# EAGLE design mainboard (EAGLE 6.1)

## Sheet 1 of 2
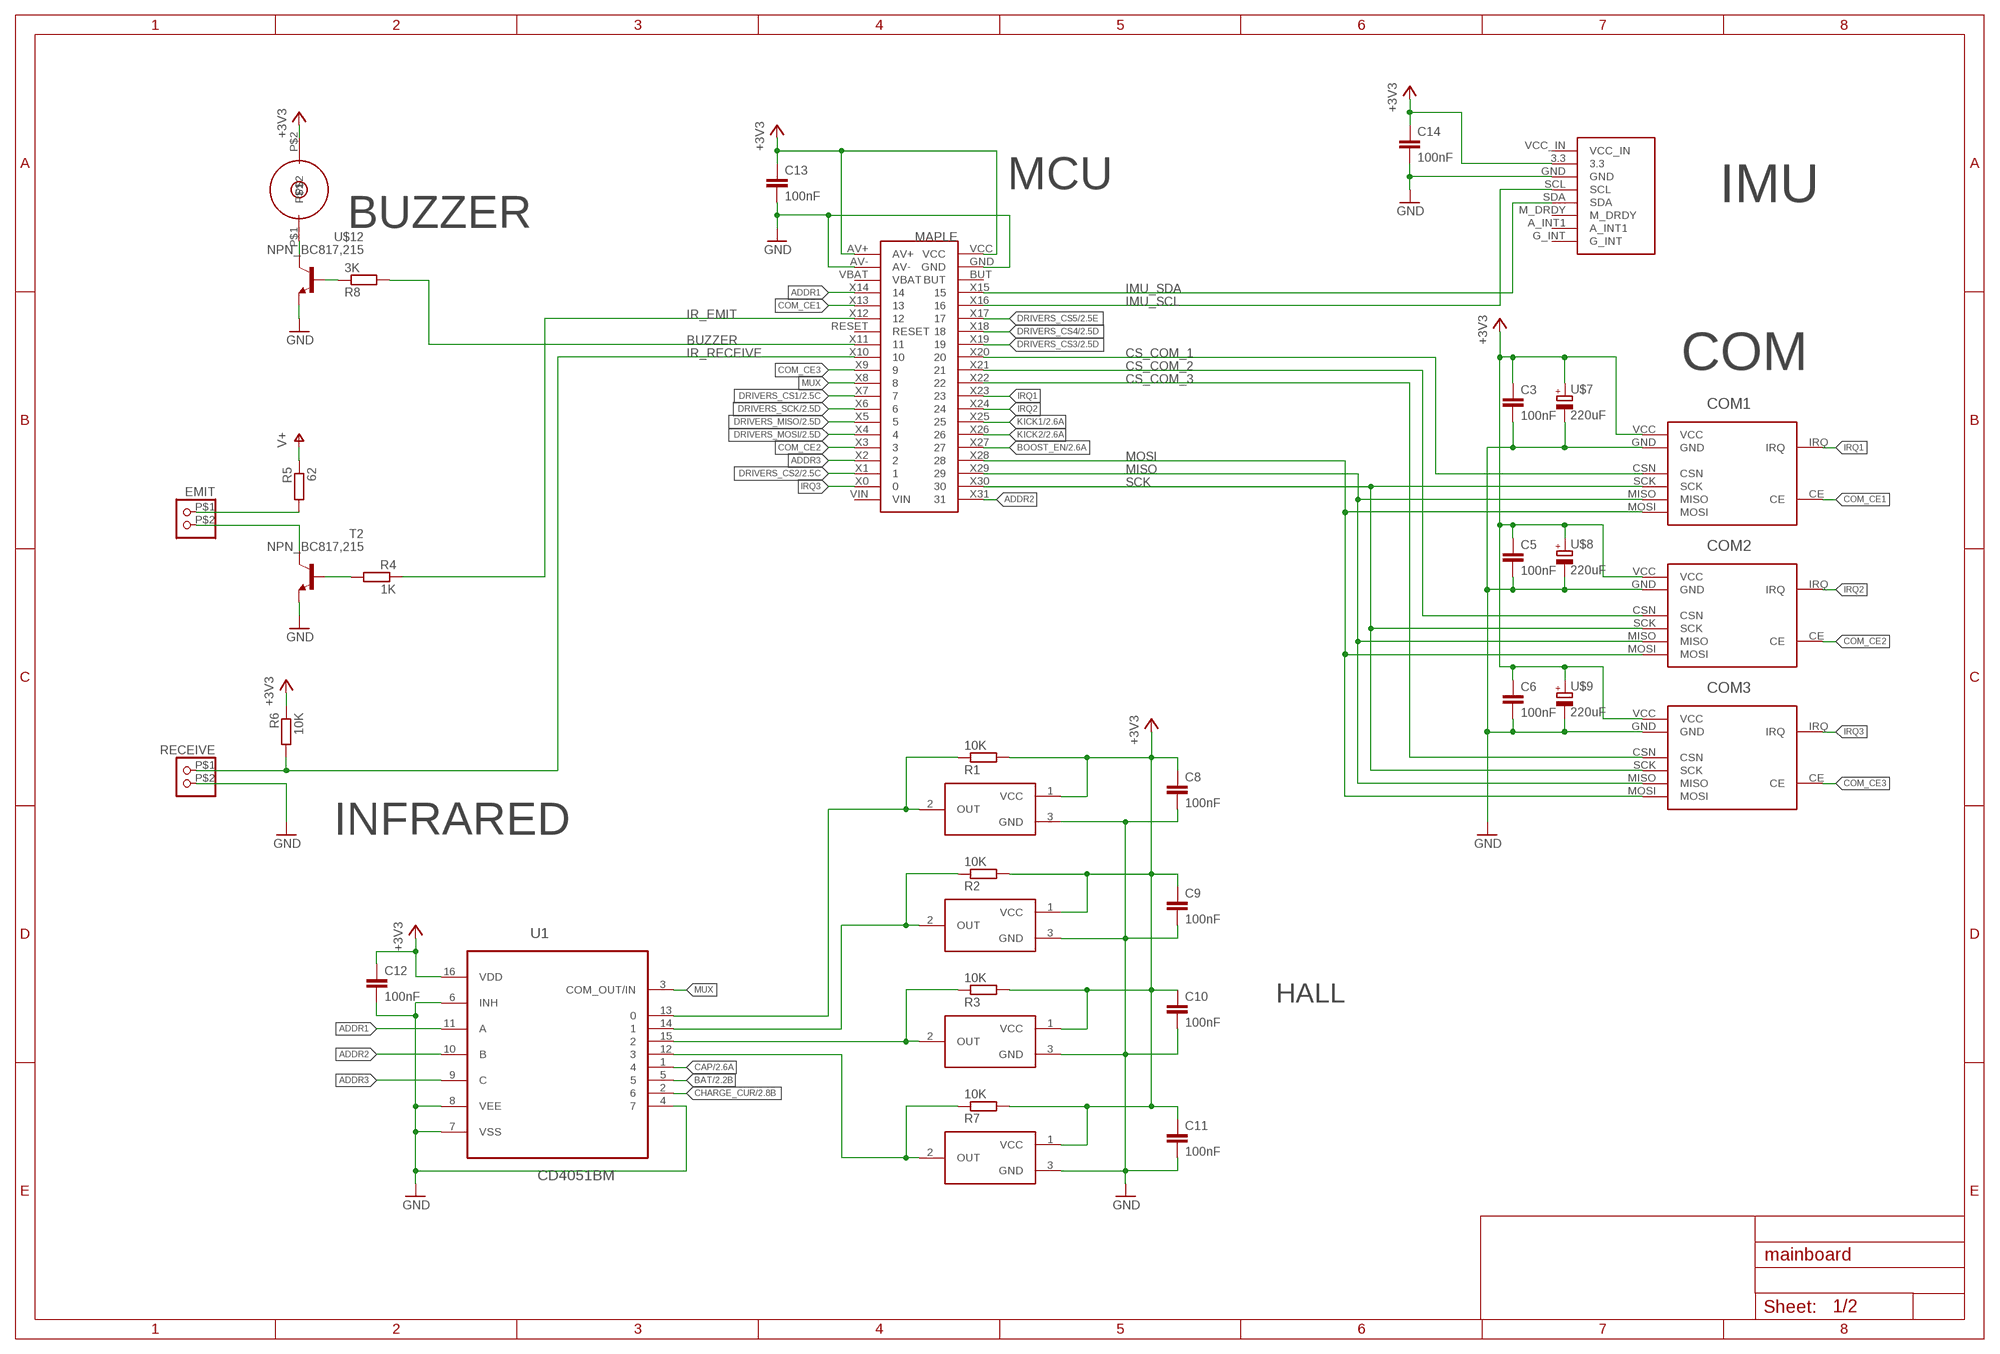
[diagram p0: schematic, sheet 1]

### Parts
C3  100nF  CAP0805  [0805@1]
C5  100nF  CAP0805  [0805@1]
C6  100nF  CAP0805  [0805@1]
C8  100nF  CAP0805  [0805@1]
C9  100nF  CAP0805  [0805@1]
C10  100nF  CAP0805  [0805@1]
C11  100nF  CAP0805  [0805@1]
C12  100nF  CAP0805  [0805@1]
C13  100nF  CAP0805  [0805@1]
C14  100nF  CAP0805  [0805@1]
COM1  NRF24L01  [NRF24L01]
COM2  NRF24L01  [NRF24L01]
COM3  NRF24L01  [NRF24L01]
EMIT  CONNEC_1X02JST-ZH  [JST_ZH_2P]
MAPLE  MAPLE_MINI  [CONNEC_2X20]
R1  10K  RESISTANCE-R0805  [R0805]
R2  10K  RESISTANCE-R0805  [R0805]
R3  10K  RESISTANCE-R0805  [R0805]
R4  1K  RESISTANCE-R0805  [R0805]
R5  62  RESISTANCE-R0805  [R0805]
R6  10K  RESISTANCE-R0805  [R0805]
R7  10K  RESISTANCE-R0805  [R0805]
R8  3K  R-EU_R0805  [R0805]
RECEIVE  CONNEC_1X02JST-ZH  [JST_ZH_2P]
T2  NPN_BC817,215  [SOT-23]
U1  CD4051BM  [SOIC127P600X175-16N]
U$1  DRV5023FAEDBZRQ1  [SOT-23]
U$2  GY-85  [GY-85]
U$5  DRV5023FAEDBZRQ1  [SOT-23]
U$7  220uF  CPOL_EUPANASONIC_D8  [PANASONIC_D8]
U$8  220uF  CPOL_EUPANASONIC_D8  [PANASONIC_D8]
U$9  220uF  CPOL_EUPANASONIC_D8  [PANASONIC_D8]
U$10  DRV5023FAEDBZRQ1  [SOT-23]
U$11  DRV5023FAEDBZRQ1  [SOT-23]
U$12  NPN_BC817,215  [SOT-23]
U$13  BUZZER66  [BUZZER66]

### Nets
+3V3: C3.1 C5.1 C6.1 C8.1 C9.1 C10.1 C11.1 C12.1 C13.1 C14.1 COM1.VCC COM2.VCC COM3.VCC MAPLE.AV+ MAPLE.VCC R1.2 R2.2 R3.2 R6.1 R7.2 U1.16(VDD) U$1.1(VCC) U$2.3.3 U$5.1(VCC) U$7.+ U$8.+ U$9.+ U$10.1(VCC) U$11.1(VCC) U$13.P$2 ; also sheet 2
ADDR1: MAPLE.X14 U1.11(A)
ADDR2: MAPLE.X31 U1.10(B)
ADDR3: MAPLE.X2 U1.9(C)
BAT: U1.5 ; also sheet 2
BOOST_EN: MAPLE.X27 ; also sheet 2
BUZZER: MAPLE.X11 R8.2
CAP: U1.1 ; also sheet 2
CHARGE_CUR: U1.2 ; also sheet 2
COM_CE1: COM1.CE MAPLE.X13
COM_CE2: COM2.CE MAPLE.X3
COM_CE3: COM3.CE MAPLE.X9
CS_COM_1: COM1.CSN MAPLE.X20
CS_COM_2: COM2.CSN MAPLE.X21
CS_COM_3: COM3.CSN MAPLE.X22
DRIVERS_CS1: MAPLE.X7 ; also sheet 2
DRIVERS_CS2: MAPLE.X1 ; also sheet 2
DRIVERS_CS3: MAPLE.X19 ; also sheet 2
DRIVERS_CS4: MAPLE.X18 ; also sheet 2
DRIVERS_CS5: MAPLE.X17 ; also sheet 2
DRIVERS_MISO: MAPLE.X5 ; also sheet 2
DRIVERS_MOSI: MAPLE.X4 ; also sheet 2
DRIVERS_SCK: MAPLE.X6 ; also sheet 2
GND [alim_big]: C3.2 C5.2 C6.2 C8.2 C9.2 C10.2 C11.2 C12.2 C13.2 C14.2 COM1.GND COM2.GND COM3.GND MAPLE.AV- MAPLE.GND RECEIVE.P$2 T2.2(E) U1.4 U1.6(INH) U1.7(VSS) U1.8(VEE) U$1.3(GND) U$2.GND U$5.3(GND) U$7.- U$8.- U$9.- U$10.3(GND) U$11.3(GND) U$12.2(E) ; also sheet 2
HALL1: R1.1 U1.13 U$1.2(OUT)
HALL2: R2.1 U1.14 U$5.2(OUT)
HALL3: R3.1 U1.15 U$10.2(OUT)
HALL4: R7.1 U1.12 U$11.2(OUT)
IMU_SCL: MAPLE.X16 U$2.SCL
IMU_SDA: MAPLE.X15 U$2.SDA
IR_EMIT: MAPLE.X12 R4.1
IR_RECEIVE: MAPLE.X10 R6.2 RECEIVE.P$1
IRQ1: COM1.IRQ MAPLE.X23
IRQ2: COM2.IRQ MAPLE.X24
IRQ3: COM3.IRQ MAPLE.X0
KICK1: MAPLE.X25 ; also sheet 2
KICK2: MAPLE.X26 ; also sheet 2
MISO: COM1.MISO COM2.MISO COM3.MISO MAPLE.X29
MOSI: COM1.MOSI COM2.MOSI COM3.MOSI MAPLE.X28
MUX: MAPLE.X8 U1.3(COM_OUT/IN)
N$3: R8.1 U$12.1(B)
N$5: U$12.3(C) U$13.P$1
N$6: EMIT.P$1 R5.2
N$7: EMIT.P$2 T2.3(C)
N$11: R4.2 T2.1(B)
SCK: COM1.SCK COM2.SCK COM3.SCK MAPLE.X30
V+ [alim_small]: R5.1 ; also sheet 2
Unconnected: MAPLE.BUT MAPLE.RESET MAPLE.VBAT MAPLE.VIN U$2.A_INT1 U$2.G_INT U$2.M_DRDY U$2.VCC_IN

### Notes on the sheet
- MCU | IMU
- BUZZER
- COM
- INFRARED
- HALL

## Sheet 2 of 2
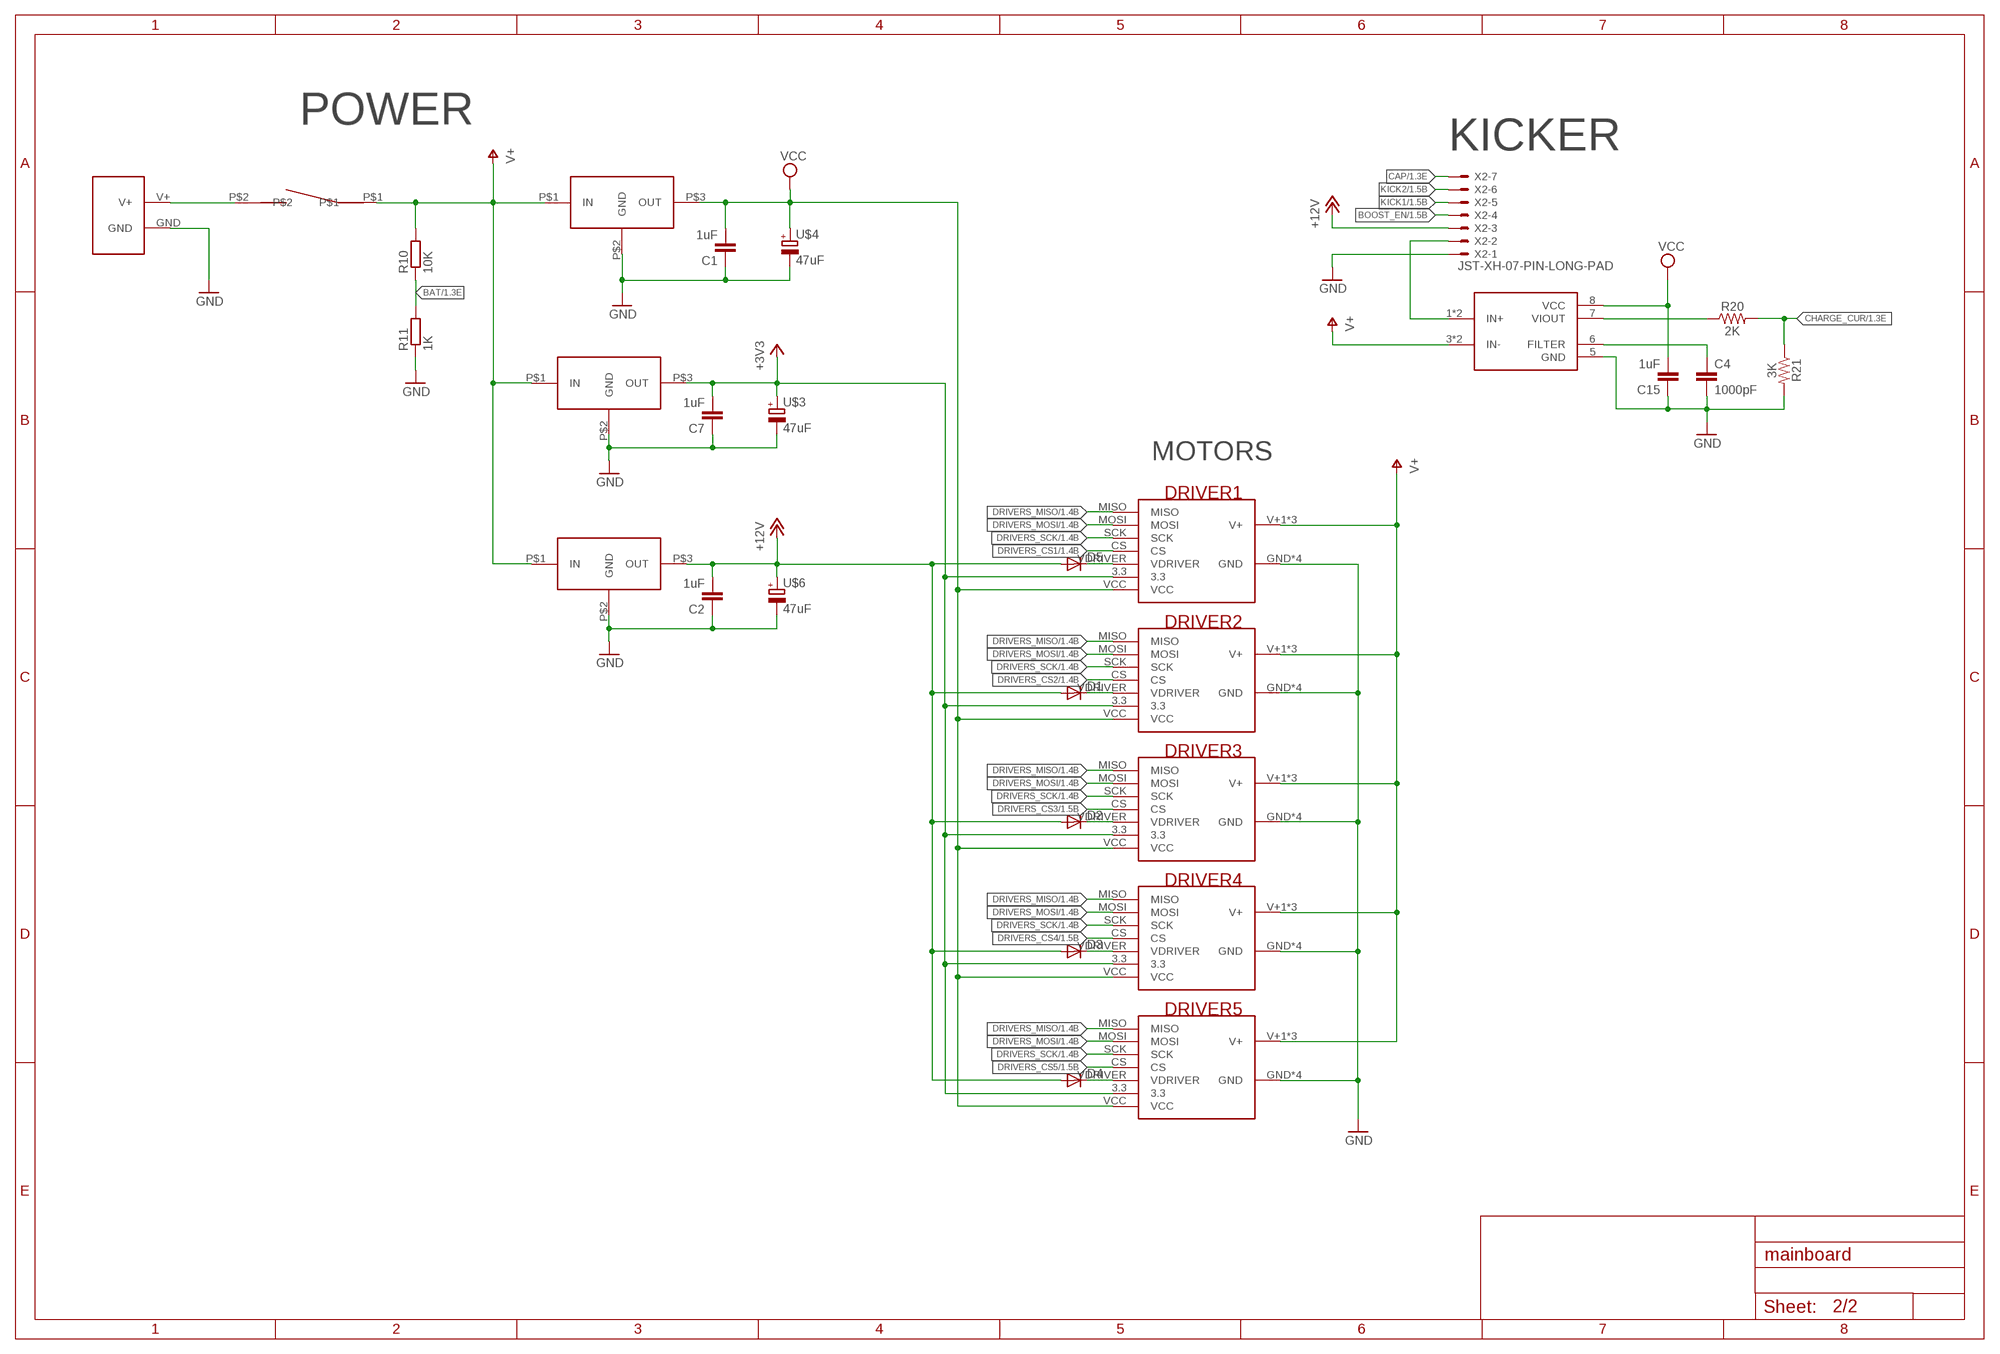
[diagram p1: schematic, sheet 2]

### Parts
C1  1uF  CAP0805  [0805@1]
C2  1uF  CAP0805  [0805@1]
C4  1000pF  CAP0805  [0805@1]
C7  1uF  CAP0805  [0805@1]
C15  1uF  CAP0805  [0805@1]
D1  DIODESOD  [SOD-323]
D2  DIODESOD  [SOD-323]
D3  DIODESOD  [SOD-323]
D4  DIODESOD  [SOD-323]
D5  DIODESOD  [SOD-323]
DRIVER1  RHOBAN_BL_DRIVER  [RHOBAN_BL_DRIVER]
DRIVER2  RHOBAN_BL_DRIVER  [RHOBAN_BL_DRIVER]
DRIVER3  RHOBAN_BL_DRIVER  [RHOBAN_BL_DRIVER]
DRIVER4  RHOBAN_BL_DRIVER  [RHOBAN_BL_DRIVER]
DRIVER5  RHOBAN_BL_DRIVER  [RHOBAN_BL_DRIVER]
R10  10K  RESISTANCE-R0805  [R0805]
R11  1K  RESISTANCE-R0805  [R0805]
R20  2K  RESISTOR0805  [0805]
R21  3K  RESISTOR0805  [0805]
REG3.3V  REG_5V  [TRACOPOWER]
REG3.3V1  REG_5V  [TRACOPOWER]
REG5V  REG_5V  [TRACOPOWER]
SENSE  ACS712  [SO8]
U$3  47uF  CPOL_EUPANASONIC_D  [PANASONIC_D]
U$4  47uF  CPOL_EUPANASONIC_D  [PANASONIC_D]
U$6  47uF  CPOL_EUPANASONIC_D  [PANASONIC_D]
U$15  SRB22A2FBBNN  [SRB22A2FBBNN]
X2  JST-XH-07-PIN-LONG-PAD  [JST-XH-07-PACKAGE-LONG-PAD]
XT60  CONNEC_ALIM  [XT60]

### Nets
+3V3: C7.2 DRIVER1.3.3 DRIVER2.3.3 DRIVER3.3.3 DRIVER4.3.3 DRIVER5.3.3 REG3.3V.P$3(OUT) U$3.+ ; also sheet 1
+12V: C2.2 D1.2(A) D2.2(A) D3.2(A) D4.2(A) D5.2(A) REG3.3V1.P$3(OUT) U$6.+ X2.3
BAT: R10.1 R11.2 ; also sheet 1
BOOST_EN: X2.4 ; also sheet 1
CAP: X2.7 ; also sheet 1
CHARGE_CUR: R20.2 R21.1 ; also sheet 1
DRIVERS_CS1: DRIVER1.CS ; also sheet 1
DRIVERS_CS2: DRIVER2.CS ; also sheet 1
DRIVERS_CS3: DRIVER3.CS ; also sheet 1
DRIVERS_CS4: DRIVER4.CS ; also sheet 1
DRIVERS_CS5: DRIVER5.CS ; also sheet 1
DRIVERS_MISO: DRIVER1.MISO DRIVER2.MISO DRIVER3.MISO DRIVER4.MISO DRIVER5.MISO ; also sheet 1
DRIVERS_MOSI: DRIVER1.MOSI DRIVER2.MOSI DRIVER3.MOSI DRIVER4.MOSI DRIVER5.MOSI ; also sheet 1
DRIVERS_SCK: DRIVER1.SCK DRIVER2.SCK DRIVER3.SCK DRIVER4.SCK DRIVER5.SCK ; also sheet 1
GND [alim_big]: C1.1 C2.1 C4.2 C7.1 C15.1 DRIVER1.GND DRIVER1.GND2(GND) DRIVER1.GND3(GND) DRIVER1.GND4(GND) DRIVER2.GND DRIVER2.GND2(GND) DRIVER2.GND3(GND) DRIVER2.GND4(GND) DRIVER3.GND DRIVER3.GND2(GND) DRIVER3.GND3(GND) DRIVER3.GND4(GND) DRIVER4.GND DRIVER4.GND2(GND) DRIVER4.GND3(GND) DRIVER4.GND4(GND) DRIVER5.GND DRIVER5.GND2(GND) DRIVER5.GND3(GND) DRIVER5.GND4(GND) R11.1 R21.2 REG3.3V1.P$2(GND) REG3.3V.P$2(GND) REG5V.P$2(GND) SENSE.5(GND) U$3.- U$4.- U$6.- X2.1 XT60.GND ; also sheet 1
KICK1: X2.5 ; also sheet 1
KICK2: X2.6 ; also sheet 1
N$1: U$15.P$2 XT60.V+
N$2: C4.1 SENSE.6(FILTER)
N$4: SENSE.1(IN+) SENSE.2(IN+) X2.2
N$8: D5.1(C) DRIVER1.VDRIVER
N$9: D3.1(C) DRIVER4.VDRIVER
N$10: D4.1(C) DRIVER5.VDRIVER
N$12: D2.1(C) DRIVER3.VDRIVER
N$13: D1.1(C) DRIVER2.VDRIVER
N$24: R20.1 SENSE.7(VIOUT)
V+ [alim_small]: DRIVER1.V+1(V+) DRIVER1.V+2(V+) DRIVER1.V+3(V+) DRIVER2.V+1(V+) DRIVER2.V+2(V+) DRIVER2.V+3(V+) DRIVER3.V+1(V+) DRIVER3.V+2(V+) DRIVER3.V+3(V+) DRIVER4.V+1(V+) DRIVER4.V+2(V+) DRIVER4.V+3(V+) DRIVER5.V+1(V+) DRIVER5.V+2(V+) DRIVER5.V+3(V+) R10.2 REG3.3V1.P$1(IN) REG3.3V.P$1(IN) REG5V.P$1(IN) SENSE.3(IN-) SENSE.4(IN-) U$15.P$1 ; also sheet 1
VCC [alim_small]: C1.2 C15.2 DRIVER1.VCC DRIVER2.VCC DRIVER3.VCC DRIVER4.VCC DRIVER5.VCC REG5V.P$3(OUT) SENSE.8(VCC) U$4.+

### Notes on the sheet
- POWER
- KICKER
- MOTORS

## Library data of the parts
C1-C3 C5-C15 = SparkFun-Passives:CAP: Capacitor Standard 0603 ceramic capacitor, and 0.1" leaded capacitor.; FARNELL: 2496946
C4 = SparkFun-Passives:CAP: Capacitor Standard 0603 ceramic capacitor, and 0.1" leaded capacitor.; FARNELL: 2496935
COM1-COM3 = rhoban:NRF24L01; FARNELL: 1668343
D1-D5 = SparkFun-DiscreteSemi:DIODE: Diode These are standard reverse protection diodes and small signal diodes. SMA package can handle up to about 1A. SOD-323 can handle about 200mA. What the SOD-323 package when ordering, there are some mfgs out there that are 5-pin packages.; FARNELL: 8737843RL
DRIVER1-DRIVER5 = rhoban:RHOBAN_BL_DRIVER; FARNELL: 1593459,1593459,1593463
EMIT = rhoban:CONNEC_1X02; FARNELL: 1212763
MAPLE = rhoban:MAPLE_MINI; FARNELL: 1593469,1593469
R1-R3 R6 R7 R10 = rhoban:RESISTANCE: RESISTOR, European symbol; FARNELL: 2447553
R4 R11 = rhoban:RESISTANCE: RESISTOR, European symbol; FARNELL: 2446904
R5 = rhoban:RESISTANCE: RESISTOR, European symbol; FARNELL: 2138819
R8 = rcl:R-EU_: RESISTOR, European symbol; FARNELL: 2446965
R20 = SparkFun-Resistors:RESISTOR: Generic Resistor Package; FARNELL: 2446939
R21 = SparkFun-Resistors:RESISTOR: Generic Resistor Package; FARNELL: 2446965
RECEIVE = rhoban:CONNEC_1X02; FARNELL: 3152856
REG3.3V = rhoban:REG_5V; FARNELL: 1696319
REG3.3V1 = rhoban:REG_5V; FARNELL: 1672130
REG5V = rhoban:REG_5V; FARNELL: 1696320
SENSE = rhoban:ACS712; FARNELL: 1329623
T2 U$12 = rhoban:NPN; FARNELL: 1081223
U1 = rhoban:CD4051BM: CMOS Analog Multiplexers/Demultiplexers with Logic Level Conversion; FARNELL: 2334931; MPN: CD4051BM; OC_FARNELL: 8388970; OC_NEWARK: 05B5595; PACKAGE: SOIC-16; SUPPLIER: Texas Instruments
U$1 U$5 U$10 U$11 = rhoban:DRV5023FAEDBZRQ1; FARNELL: 2673327RL
U$2 = rhoban:GY-85; FARNELL: 1593463
U$3 U$4 U$6 = rhoban:CPOL_EU: 47uF: http://fr.farnell.com/panasonic-electronic-components/eee1ca470sp/condensateur-elec-alu-47uf-16v/dp/9696946 220uF: http://fr.farnell.com/panasonic-electronic-components/eeefk1c221xp/condensateur-elec-alu-220uf-16v/dp/1850103; FARNELL: 9696946
U$7-U$9 = rhoban:CPOL_EU: 47uF: http://fr.farnell.com/panasonic-electronic-components/eee1ca470sp/condensateur-elec-alu-47uf-16v/dp/9696946 220uF: http://fr.farnell.com/panasonic-electronic-components/eeefk1c221xp/condensateur-elec-alu-220uf-16v/dp/1850103; FARNELL: 1850103
U$13 = rhoban:BUZZER; FARNELL: -
U$15 = rhoban:SRB22A2FBBNN; FARNELL: 1383947
X2 = Rembrandt Electronics - JST XH Connectors v1-0:JST-XH-07-PIN: JST XH Connector 2 Pin Wire to board connector. Pitch: 2,54 mm, (0.100") Number of pins: 7 Created by Rembrandt Electronics www.rembrandtelectronics.com
XT60 = rhoban:CONNEC_ALIM; FARNELL: -

## Net classes
0 default: width 0.254 mm
1 alim_small: width 0.508 mm
2 alim_big: width 1.524 mm
3 alim_very_big: width 0.762 mm

## Board
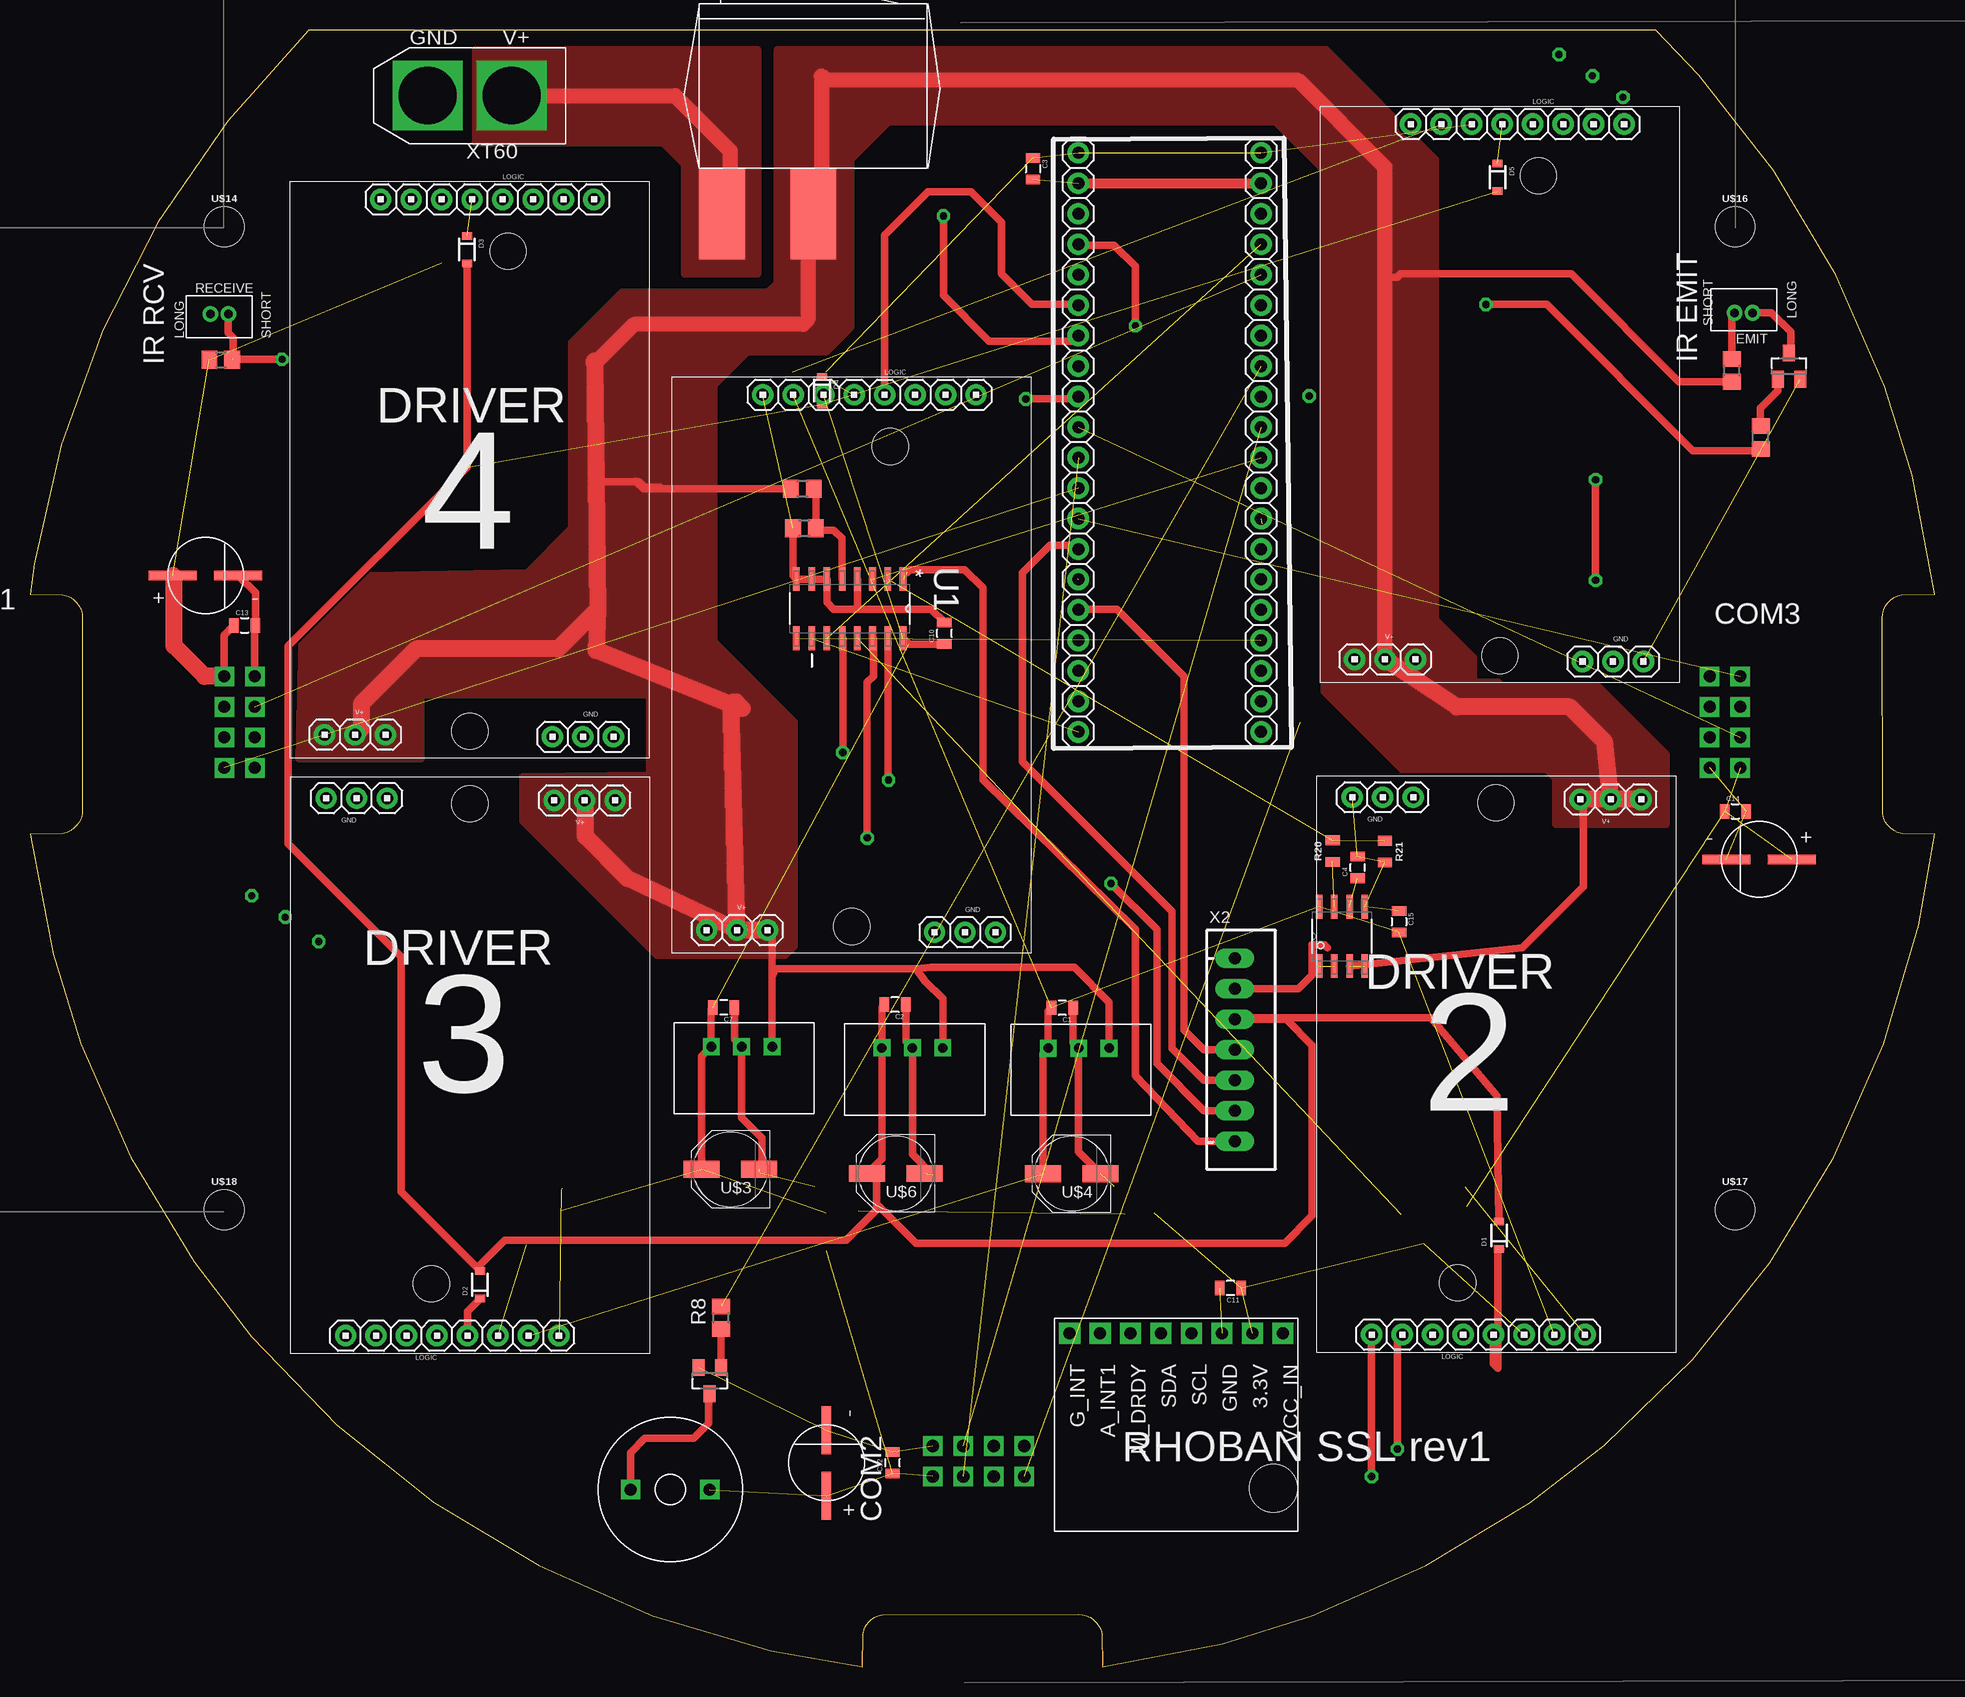
[diagram p2: board, top side]
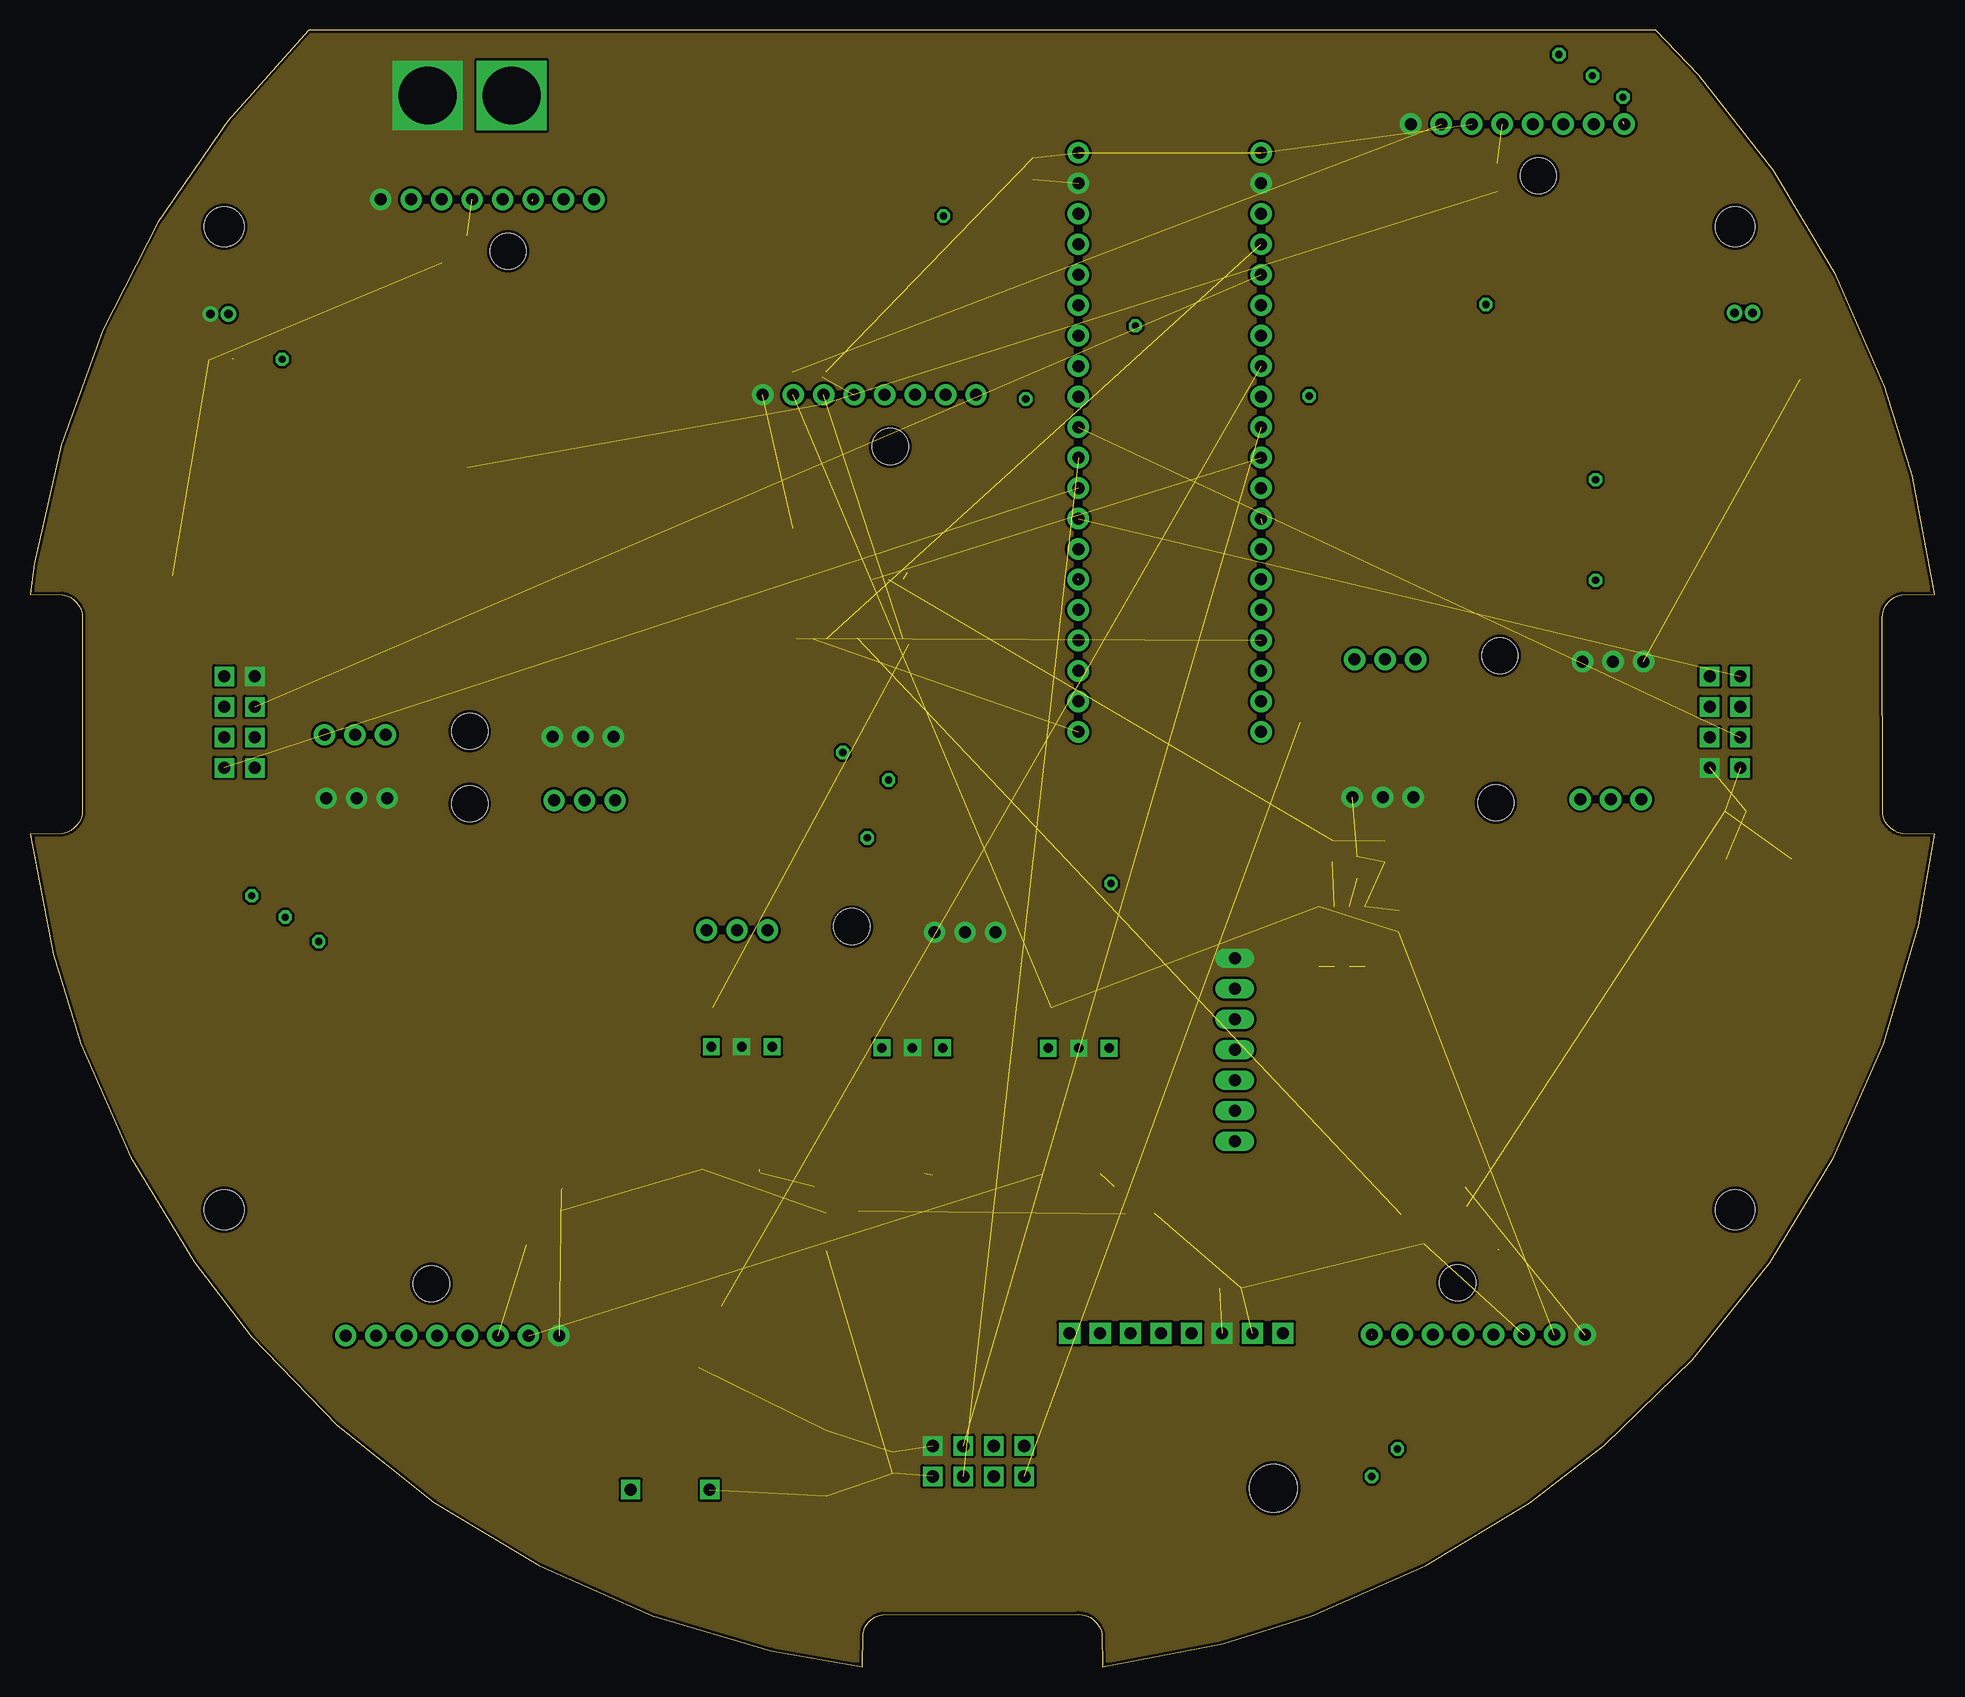
[diagram p3: board, inner layer Route2]
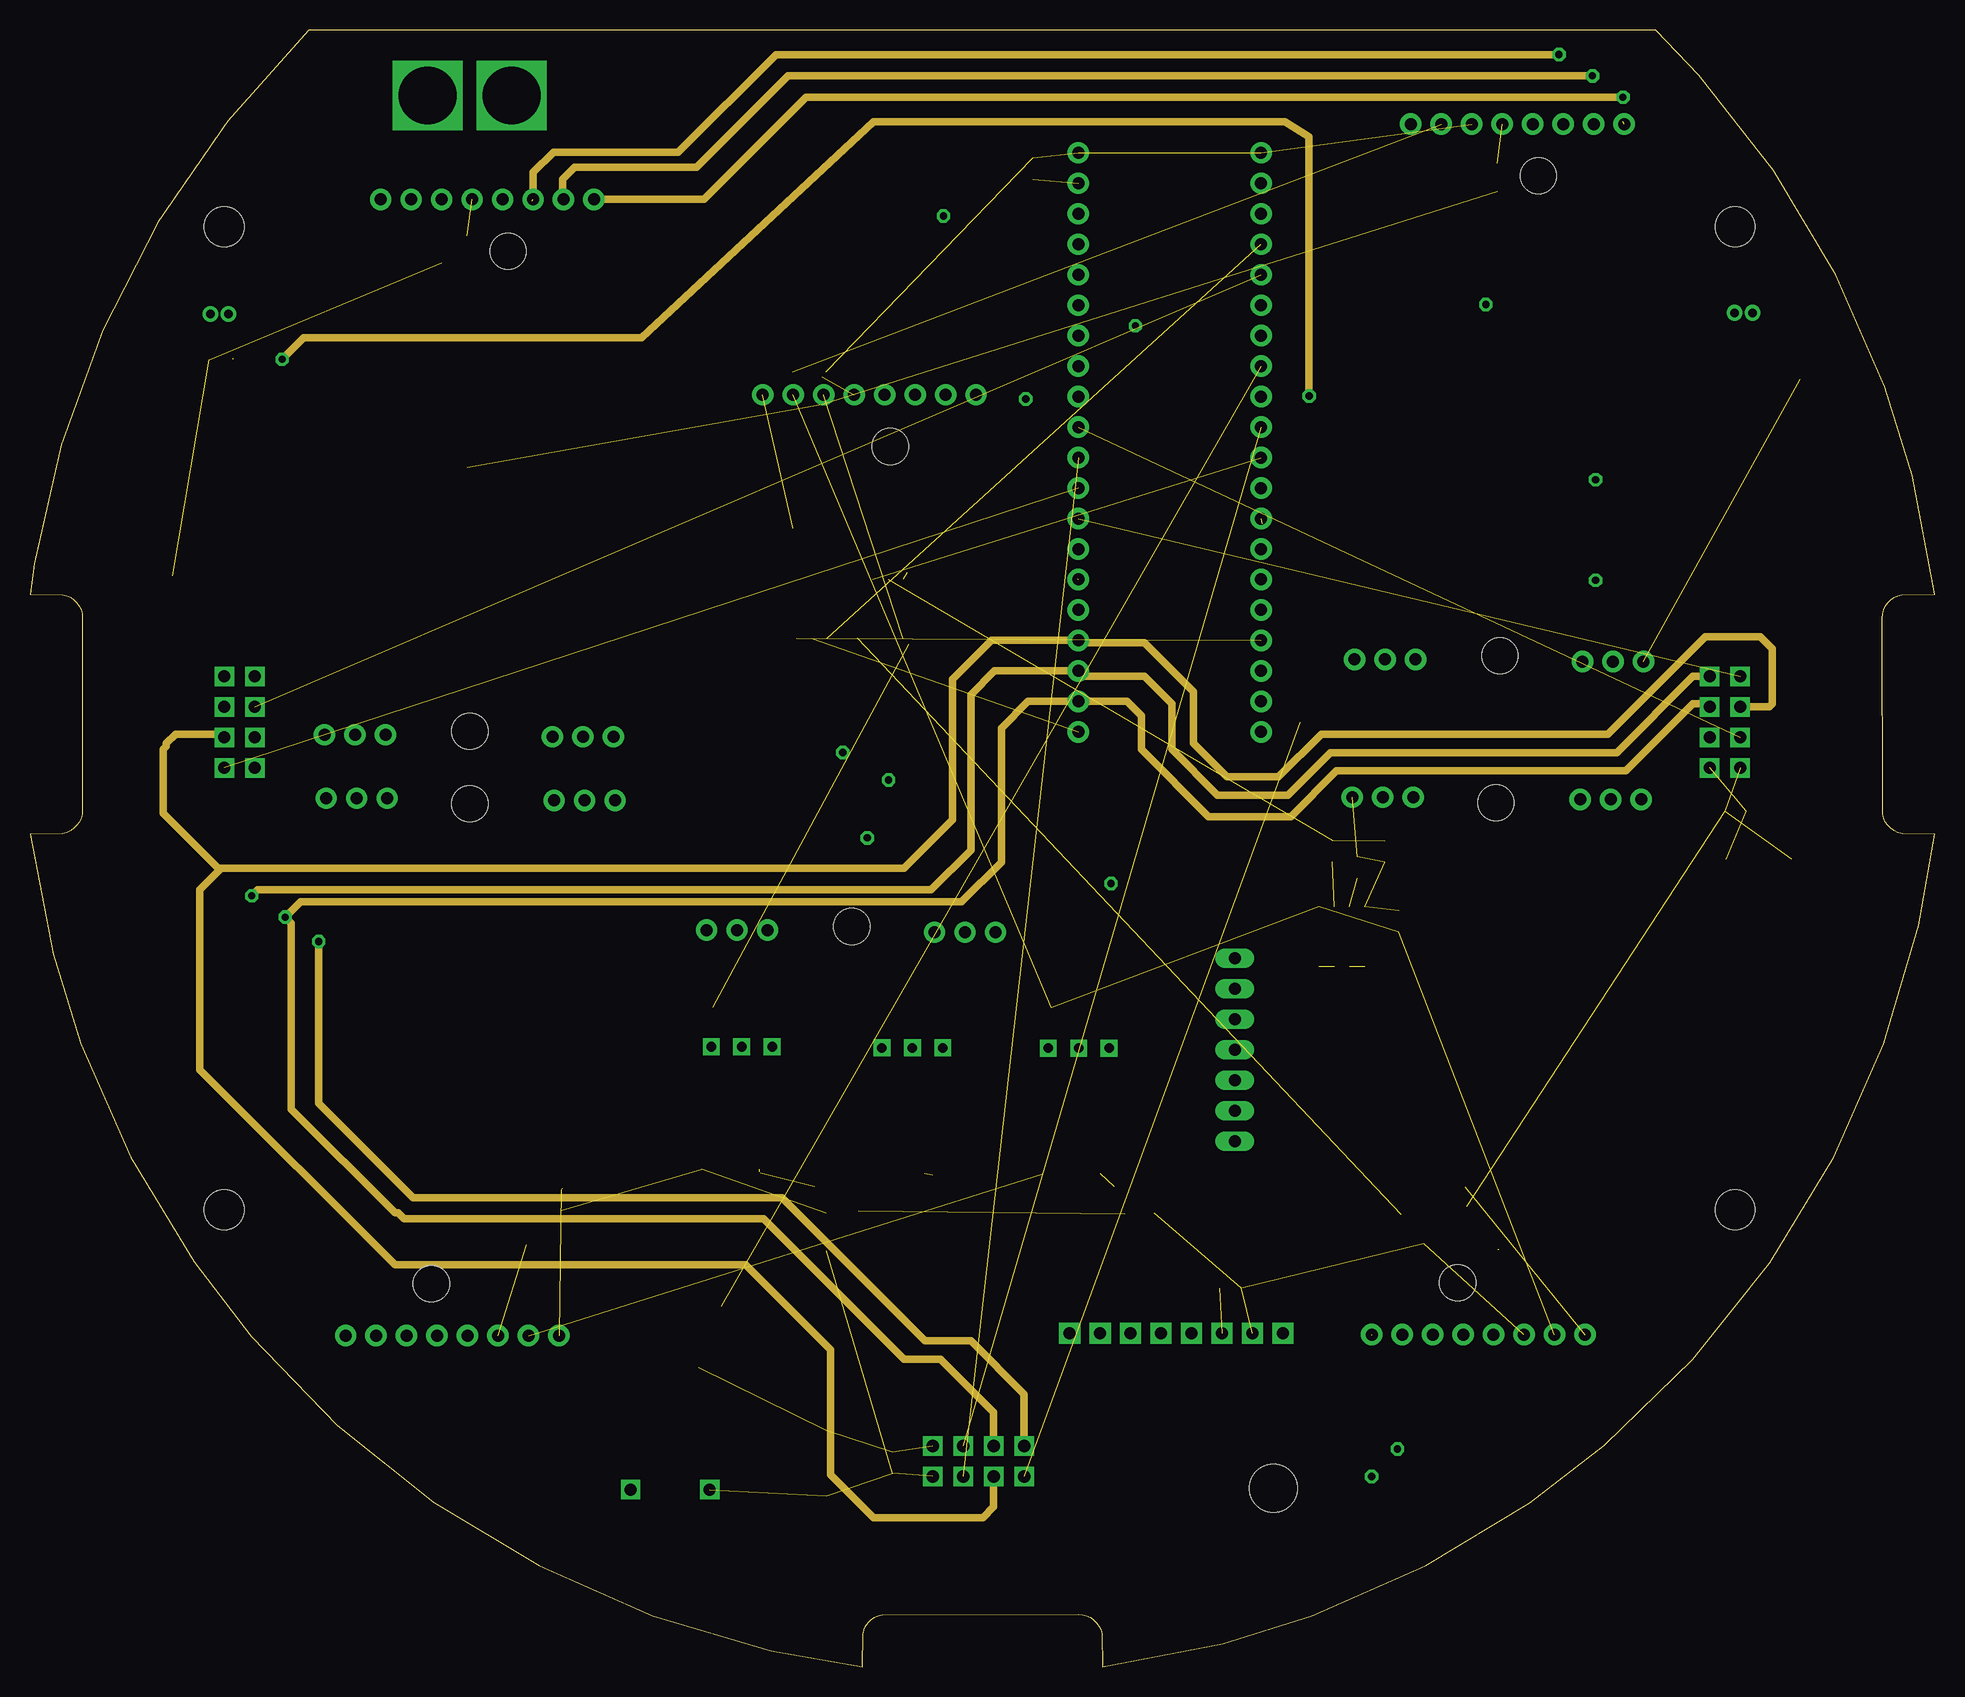
[diagram p4: board, inner layer Route15]
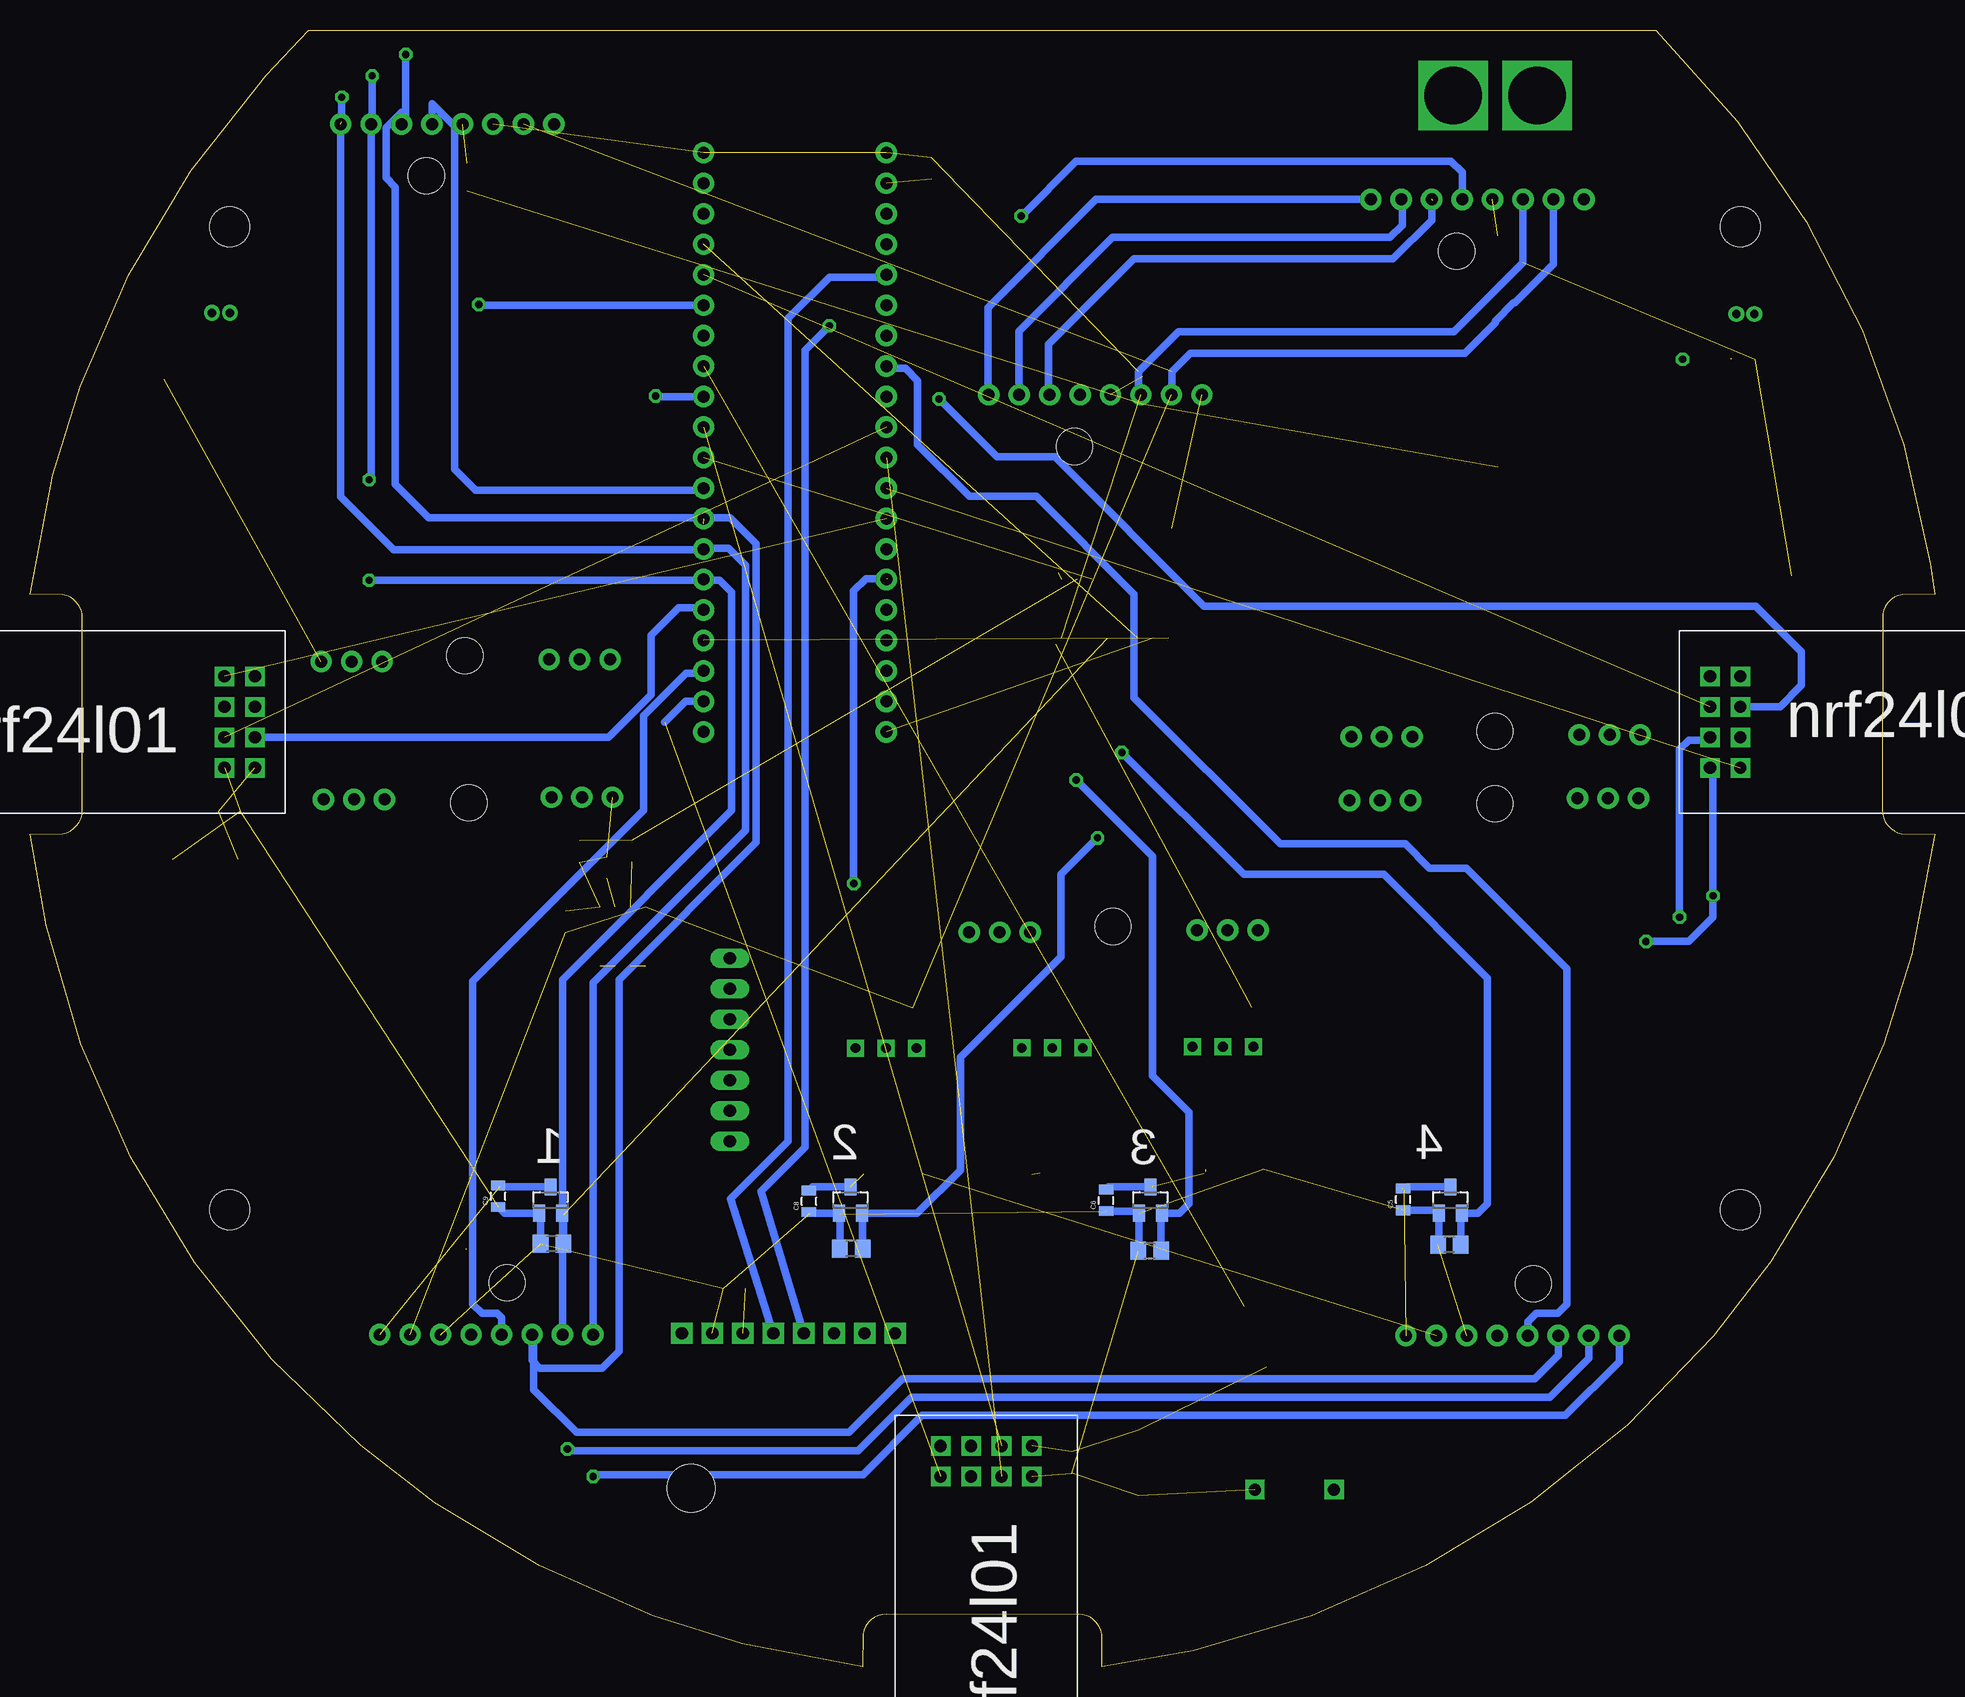
[diagram p5: board, bottom side, seen from below]

Size 158.77 x 136.39 mm. Coordinates in mm from the lower left corner, seen from the top.
Outline: 88.66,3.91 88.91,3.66 89.11,3.38 89.25,3.07 89.34,2.73 89.38,0 99.41,1.92 106.87,4.24 116.3,8.4 125.04,13.68 131.23,18.44 138.62,25.61 145.04,33.66 150.37,42.47 154.52,51.9 157.43,61.77 158.77,69.39 156.05,69.42 155.71,69.51 155.71,69.51 155.7,69.51 155.39,69.66 155.1,69.86 154.86,70.11 154.66,70.39 154.51,70.7 154.42,71.04 154.39,87.39 154.42,87.73 154.51,88.07 154.66,88.38 154.86,88.66 155.1,88.91 155.39,89.11 155.7,89.25 156.04,89.34 158.77,89.38 156.88,99.29 154.6,106.66 150.53,115.98 145.32,124.71 139.09,132.64 135.52,136.39 23.25,136.39 16.47,128.81 10.71,120.43 6.05,111.39 2.59,101.83 0.36,91.9 0,89.37 2.72,89.35 3.06,89.26 3.06,89.26 3.07,89.25 3.38,89.11 3.66,88.91 3.91,88.66 4.11,88.38 4.25,88.07 4.34,87.73 4.37,71.38 4.34,71.04 4.25,70.7 4.11,70.39 3.91,70.11 3.66,69.86 3.38,69.66 3.07,69.52 2.73,69.43 0,69.39 1.92,59.36 4.24,51.9 8.4,42.47 13.68,33.73 18.44,27.54 25.61,20.14 33.66,13.73 42.47,8.4 51.9,4.25 61.77,1.34 69.39,0 69.42,2.72 69.51,3.06 69.51,3.06 69.51,3.07 69.66,3.38 69.86,3.66 70.11,3.91 70.39,4.11 70.7,4.25 71.04,4.34 87.38,4.37 87.73,4.34 88.07,4.25 88.38,4.11 88.66,3.91
Copper layers (1*2*15*16): Top 0.035mm / dielectric 0.4mm / Route2 0.035mm / dielectric 0.4mm / Route15 0.035mm / dielectric 0.4mm / Bottom 0.035mm
Design rules: minimum track width 8mil, minimum drill 20mil, track to track 8mil, track to pad 8mil, pad to pad 8mil, via to via 8mil, smd to smd 8mil, copper to edge 10mil, drill to drill 8mil, minimum pad ring 12mil, minimum via ring 10mil, stop-mask expansion 4mil, vias tented up to drill 25mil, thermal gap 10mil
tRestrict: area 13,116.8 to 19.4,123.2; area 138.9,116.8 to 145.3,123.2; area 139.1,34.9 to 145.4,41.3; area 13,34.9 to 19.4,41.3
bRestrict: area 13,116.8 to 19.4,123.2; area 138.9,116.8 to 145.3,123.2; area 139.1,34.9 to 145.4,41.3; area 13,34.9 to 19.4,41.3

### Footprints (pad centres in the part's own frame; a part is rotated, then mirrored left to right if it is on the bottom)
0805@1 = smd 0.8 x 1.2: 1 -0.9,0; 2 0.9,0
NRF24L01 = drill 1.016 square: CE 2.54,0; CSN 2.54,2.54; GND 0,0; IRQ 7.62,2.54; MISO 7.62,0; MOSI 5.08,2.54; SCK 5.08,0; VCC 0,2.54
SOD-323 = smd 0.63 x 0.83: 1 -1.15,0; 2 1.15,0
RHOBAN_BL_DRIVER = drill 1 pad 1.778: 3.3 17.247,-0.513; CS 12.167,-0.513; GND 22.327,-0.513; GND2 8.01,44.27; GND3 5.47,44.27; GND4 2.93,44.27; MISO 4.547,-0.513; MOSI 7.087,-0.513; SCK 9.627,-0.513; V+1 27.01,44.093; V+2 24.47,44.093; V+3 21.93,44.093; VCC 19.787,-0.513; VDRIVER 14.707,-0.513 | hole 3: 14.9,43.8; 11.7,3.8
JST_ZH_2P = drill 0.7: P$1 1.27,0; P$2 -0.23,0
CONNEC_2X20 = drill 1 pad 1.778: AV+ 0,0; AV- 2.54,0; BUT 5.08,-15.24; GND 2.54,-15.24; RESET 15.24,0; VBAT 5.08,0; VCC 0,-15.24; VIN 48.26,0; X0 45.72,0; X1 43.18,0; X2 40.64,0; X3 38.1,0; X4 35.56,0; X5 33.02,0; X6 30.48,0; X7 27.94,0; X8 25.4,0; X9 22.86,0; X10 20.32,0; X11 17.78,0; X12 12.7,0; X13 10.16,0; X14 7.62,0; X15 7.62,-15.24; X16 10.16,-15.24; X17 12.7,-15.24; X18 15.24,-15.24; X19 17.78,-15.24; X20 20.32,-15.24; X21 22.86,-15.24; X22 25.4,-15.24; X23 27.94,-15.24; X24 30.48,-15.24; X25 33.02,-15.24; X26 35.56,-15.24; X27 38.1,-15.24; X28 40.64,-15.24; X29 43.18,-15.24; X30 45.72,-15.24; X31 48.26,-15.24
R0805 = smd 1.3 x 1.5: 1 -0.95,0; 2 0.95,0
0805 = smd 0.8 x 1.2: 1 -0.9,0; 2 0.9,0
TRACOPOWER = drill 0.8 square: P$1 3.5,2; P$2 6.04,2; P$3 8.58,2
SO8 = smd 1.981 x 0.533: 1 -2.464,1.905; 2 -2.464,0.635; 3 -2.464,-0.635; 4 -2.464,-1.905; 5 2.464,-1.905; 6 2.464,-0.635; 7 2.464,0.635; 8 2.464,1.905
SOT-23 = smd 1 x 1.4: 1 -0.95,-1.1; 2 0.95,-1.1; 3 0,1.1
SOIC127P600X175-16N = smd 1.981 x 0.559: 1 -2.464,4.445; 2 -2.464,3.175; 3 -2.464,1.905; 4 -2.464,0.635; 5 -2.464,-0.635; 6 -2.464,-1.905; 7 -2.464,-3.175; 8 -2.464,-4.445; 9 2.464,-4.445; 10 2.464,-3.175; 11 2.464,-1.905; 12 2.464,-0.635; 13 2.464,0.635; 14 2.464,1.905; 15 2.464,3.175; 16 2.464,4.445
GY-85 = drill 1.016 pad 1.778 square: 3.3 0,15.24; A_INT1 0,2.54; G_INT 0,0; GND 0,12.7; M_DRDY 0,5.08; SCL 0,10.16; SDA 0,7.62; VCC_IN 0,17.78 | hole 4: 12.9,17
PANASONIC_D = smd 3 x 1.4: + 2.4,0; - -2.4,0
PANASONIC_D8 = smd 4.016 x 0.8: + 2.73,0; - -2.73,0
BUZZER66 = drill 1 square: P$1 -3.3,0; P$2 3.3,0
STAND-OFF = hole 3.302: 0,0
SRB22A2FBBNN = smd 3.81 x 7.62: P$1 9.5,-3.8; P$2 1.9,-3.8
JST-XH-07-PACKAGE-LONG-PAD = drill 1.016 long: 1 -7.62,0; 2 -5.08,0; 3 -2.54,0; 4 0,0; 5 2.54,0; 6 5.08,0; 7 7.62,0
XT60 = drill 4.8 square: GND 11.5,4; V+ 4.5,4

### Placement (x,y rotation side)
C1  86.05,54.92 180 top
C2  72.1,55.17 180 top
C3  83.61,124.84 270 top
C4  110.67,66.61 90 top
C5  44.31,38.94 90 bottom
C6  69.08,38.86 90 bottom
C7  57.82,54.95 180 top
C8  93.84,38.78 90 bottom
C9  119.75,39.21 90 bottom
C10  76.22,86.12 90 top
C11  100.06,31.56 180 top
C12  71.9,17.01 90 top
C13  17.9,86.77 0 top
C14  142.15,71.28 0 top
C15  114.11,62.09 270 top
COM1  18.73,82.53 270 bottom
COM2  140.02,74.91 90 bottom
COM3  75.25,18.4 180 bottom
D1  122.45,35.95 90 top
D2  37.51,31.83 90 top
D3  36.43,118.1 270 top
D4  66.02,106.34 270 top
D5  122.33,124.13 270 top
DRIVER1  137.42,128.04 180 top
DRIVER2  107.29,28.19 0 top
DRIVER3  21.76,28.1 0 top
DRIVER4  51.56,121.76 180 top
DRIVER5  83.41,105.48 180 top
EMIT  143.36,112.82 180 top
MAPLE  102.62,126.16 270 top
R1  115.26,35.25 180 bottom
R2  90.31,34.85 180 bottom
R3  65.43,34.65 180 bottom
R4  144.26,102.44 90 top
R5  141.86,108.03 90 top
R6  15.9,108.92 0 top
R7  40.46,35.18 180 bottom
R8  57.6,29.08 90 top
R10  64.37,98.14 180 top
R11  64.55,94.88 0 top
R20  108.57,67.98 90 top
R21  112.94,67.94 270 top
RECEIVE  15.27,112.73 0 top
REG3.3V  65.37,53.67 180 top
REG3.3V1  79.59,53.58 180 top
REG5V  93.45,53.56 180 top
SENSE  109.36,60.86 90 top
T2  146.62,108.38 0 top
U1  68.33,88.18 270 top
U$1  115.38,38.88 0 bottom
U$2  86.65,27.78 270 top
U$3  58.39,41.45 180 top
U$4  86.83,41.09 180 top
U$5  90.38,38.88 0 bottom
U$6  72.16,41.11 180 top
U$7  14.63,90.93 180 top
U$8  144.13,67.28 0 top
U$9  66.38,16.98 270 top
U$10  65.38,38.88 0 bottom
U$11  40.38,38.88 0 bottom
U$12  56.66,23.84 180 top
U$13  53.36,14.76 0 top
U$14  [STAND-OFF]  16.19,120 0 top
U$15  55.78,124.88 0 top
U$16  [STAND-OFF]  142.12,120 0 top
U$17  [STAND-OFF]  142.12,38.08 0 top
U$18  [STAND-OFF]  16.19,38.08 0 top
X2  100.43,51.42 270 top
XT60  44.64,134.93 180 top

### Tracks (layer width: path | path; a pad name or v marks a point on that pad's centre or on a via)
+3V3  (23 unrouted)
  Top 0.61: U$3.+ 55.99,50.87 REG3.3V.P$3 56.79,54.81 C7.2 | C10.1 73.26,85.22 U1.16 | COM1.VCC 16.19,85.97 C13.1
  Top 1.422: COM1.VCC 14.54,82.53 12,85.07 12,90.84 U$7.+
  Bottom 0.61: C5.1 41.59,38.04 U$11.1 41.33,35.25 R7.2 | C6.1 66.51,37.96 U$10.1 66.33,34.7 R3.2 | R2.2 91.26,37.71 U$5.1 93.74,37.78 C8.1 | R1.2 116.21,37.66 U$1.1 119.22,37.78 C9.1 | DRIVER4.3.3 34.31,116.99 40.07,111.24 63.06,111.24 66.36,107.93 66.36,106.19 DRIVER5.3.3
+12V  (2 unrouted)
  Top 0.61: 70.17,41.51 71.01,42.35 REG3.3V1.P$3 71.01,54.97 C2.2 | 70.17,41.51 U$6.+ 69.76,40.98 69.53,40.75 | D1.2 122.28,47.57 116.78,54.09 101.32,54.09 X2.3 104.71,53.96 106.87,51.8 106.87,37.58 104.59,35.29 73.85,35.29 70.55,38.59 | 70.55,38.59 70.55,38.08 68.01,35.54 39.56,35.54 37.51,33.5 D2.2 30.93,39.57 30.93,59.17 21.53,68.56 21.53,85.07 36.43,99.97 D3.2 | 70.55,38.59 70.55,41.13 70.17,41.51
ADDR1  (1 unrouted)
ADDR2  (1 unrouted)
ADDR3  (1 unrouted)
BAT
  Top 0.61: U1.5 67.7,94.02 66.99,94.73 65.66,94.73 R11.2 65.5,97.97 R10.1
BOOST_EN
  Top 0.61: X2.4 97.85,51.42 96.2,53.07 96.2,82.53 90.62,88.12 87.44,88.12 MAPLE.X27
BUZZER  (1 unrouted)
CAP  (1 unrouted)
  Top 0.61: X2.7 97.35,43.8 92.14,49.26 92.14,61.45 79.44,73.9 79.44,89.9 77.92,91.42 73.34,91.42 73.09,91.17
CHARGE_CUR  (2 unrouted)
COM_CE1  (1 unrouted)
COM_CE2
  Bottom 0.61: COM2.CE 110.56,77.45 107,81.01 107,85.96 104.71,88.25 102.81,88.25 MAPLE.X3
COM_CE3  (1 unrouted)
CS_COM_1  (via drill 0.6)
  Top 0.61: v83,105.65 87.18,105.65 MAPLE.X20
  Bottom 0.61: COM1.CSN 12.89,79.99 11.11,81.77 11.11,84.57 14.92,88.38 60.9,88.38 73.34,100.82 78.17,100.82 v83,105.65
CS_COM_2  (1 unrouted)
CS_COM_3  (1 unrouted)
DRIVERS_CS1
  Bottom 0.61: DRIVER1.CS 125.26,130.26 123.38,128.38 123.38,99.81 121.6,98.03 102.81,98.03 MAPLE.X7
DRIVERS_CS2
  Bottom 0.61: DRIVER2.CS 119.46,29.08 119.83,29.45 121.1,29.45 121.86,30.21 121.86,57.13 107.63,71.36 107.63,79.23 104.08,82.79 102.81,82.79 MAPLE.X1
DRIVERS_CS3
  Bottom 0.61: DRIVER3.CS 33.93,28.73 33.21,29.45 31.43,29.45 30.67,30.21 30.67,58.15 39.05,66.53 42.1,66.53 44.13,68.56 54.55,68.56 66.74,80.76 66.74,89.39 74.87,97.52 80.46,97.52 84.77,101.84 84.77,107.17 85.79,108.19 87.57,108.19 MAPLE.X19
DRIVERS_CS4  (via drill 0.6)
  Top 0.61: v76.14,120.89 76.14,114.28 79.95,110.47 86.93,110.47 MAPLE.X18
  Bottom 0.61: DRIVER4.CS 39.39,124.53 40.32,125.46 71.57,125.46 v76.14,120.89
DRIVERS_CS5
  Top 0.61: DRIVER5.CS 71.24,119.29 74.87,122.92 78.42,122.92 80.96,120.38 80.96,116.06 83.5,113.52 87.32,113.52 MAPLE.X17
DRIVERS_MISO  (via drill 0.6)  (2 unrouted)
  Top 0.61: v111.83,15.86 111.83,27.42 111.7,27.54 111.83,27.67 | 111.57,27.67 111.83,27.67 | 111.83,27.67 112.21,27.67 112.33,27.54
  Route15 0.61: DRIVER4.MISO 56.19,122.28 64.71,130.79 v132.78,130.79
  Bottom 0.61: DRIVER3.MISO 26.31,25.43 30.8,20.94 84.39,20.94 89.35,15.99 111.7,15.99 v111.83,15.86 | DRIVER1.MISO 132.88,97.49 128.46,93.08 102.69,93.08 MAPLE.X5 102.56,93.2 100.52,93.2 99.13,91.81 99.13,69.71 111.84,56.99 DRIVER2.MISO | DRIVER5.MISO 78.93,106.07 78.93,113.27 69.92,122.28 DRIVER4.MISO | v132.78,130.79 132.78,128.76 132.53,128.51 133.29,128.51
DRIVERS_MOSI  (via drill 0.6)
  Top 0.61: v113.98,18.15 113.98,27.28 DRIVER2.MOSI | v130.49,98.92 v130.49,90.54
  Route15 0.61: v44.39,122.19 44.39,123.94 45.4,124.95 55.56,124.95 63.18,132.57 v130.24,132.57
  Bottom 0.61: DRIVER3.MOSI 28.85,25.69 32.07,22.46 85.28,22.46 89.73,18.02 113.86,18.02 v113.98,18.15 | v130.49,98.92 130.34,99.2 DRIVER1.MOSI 130.3,128.51 130.24,128.51 v130.24,132.57 | v130.49,90.54 102.93,90.54 MAPLE.X4 102.55,90.54 101.28,90.54 100.27,89.52 100.27,71.36 114.38,57.25 DRIVER2.MOSI | DRIVER5.MOSI 76.32,111.31 68.52,119.11 45.4,119.11 44.39,120.13 v44.39,122.19 DRIVER4.MOSI
DRIVERS_SCK  (via drill 0.6)  (2 unrouted)
  Route15 0.61: DRIVER4.SCK 41.93,124.53 43.63,126.22 54.04,126.22 62.17,134.35 v127.45,134.35
  Bottom 0.61: DRIVER3.SCK 31.39,25.94 33.34,23.99 86.04,23.99 90.49,19.54 113.22,19.54 116.78,23.1 116.78,27.53 DRIVER2.SCK 116.92,25.53 116.27,24.88 111.06,24.88 109.67,26.27 109.67,57.26 98.24,68.69 98.24,93.58 100.4,95.74 102.56,95.74 MAPLE.X6 | 102.68,95.23 103.19,95.74 125.54,95.74 128.34,98.54 128.34,123.3 129.1,124.06 129.1,128.25 127.8,129.55 DRIVER1.SCK 127.45,128.9 v127.45,134.35 | DRIVER5.SCK 73.85,106.07 73.85,110.22 66.74,117.33 45.15,117.33 41.93,120.55 41.93,122.07 41.85,122.16
GND  (20 unrouted)
  Top 0.61: 60.9,41.13 60.77,41.26 60.64,41.26 61.03,41.64 61.03,44.05 59.33,45.75 REG3.3V.P$2 58.72,52.27 C7.1 | 75.25,41.01 73.55,42.71 REG3.3V1.P$2 73.01,52.12 C2.1 | U$4.- 87.41,42.91 REG5V.P$2 86.95,52.02 C1.1 | 69.03,88.12 66.99,88.12 66.43,88.69 U1.6 U1.7 U1.8 63.6,90.93 R11.1 | 69.03,88.12 75.12,88.12 C10.2 | U1.4 68.97,88.18 69.03,88.12 | COM1.GND 18.73,86.71 C13.2 18.8,89.5 U$7.-
  Top 0.813: MAPLE.GND MAPLE.AV-
  Bottom 0.61: U$11.3 44.01,39.98 44.26,39.74 44.39,39.86 | U$10.3 68.85,39.98 C6.2 | U$5.3 93.54,39.98 C8.2 | U$1.3 119.62,39.98 C9.2
  pour Route2 (no thermals): -3.87,137.65 163.01,137.91 164.02,-6.62 -2.86,-6.87
HALL1  (1 unrouted)
  Bottom 0.61: R1.1 114.31,37.66 U$1.2
HALL2  (via drill 0.6)
  Top 0.61: v69.79,69.07 69.79,82.03 70.3,82.53 70.3,85.65 U1.14
  Bottom 0.61: R2.1 89.36,37.71 U$5.2 84.82,37.78 81.22,41.39 81.22,50.78 72.84,59.17 72.84,66.02 v69.79,69.07
HALL3  (via drill 0.6)
  Top 0.61: U1.15 71.51,74.21 71.57,74.15 v71.57,73.9
  Bottom 0.61: R3.1 64.48,37.73 U$10.2 62.98,37.78 62.17,38.59 62.17,46.21 65.22,49.26 65.22,67.55 v71.57,73.9
HALL4  (via drill 0.6)
  Top 0.61: v67.76,76.18 67.76,85.65 U1.12
  Bottom 0.61: R7.1 39.51,37.71 U$11.2 38.08,37.78 37.28,38.59 37.28,57.39 45.91,66.02 57.6,66.02 v67.76,76.18
IMU_SCL
  Bottom 0.61: U$2.SCL 100.37,39 95.57,43.8 95.57,112.38 92.14,115.81 87.57,115.81 MAPLE.X16
IMU_SDA  (via drill 0.6)
  Top 0.61: v92.14,111.74 92.14,116.7 90.36,118.48 87.45,118.48 MAPLE.X15
  Bottom 0.61: U$2.SDA 97.83,39.63 94.17,43.29 94.17,109.71 v92.14,111.74
IR_EMIT  (via drill 0.6)
  Top 0.61: v121.35,113.52 126.43,113.52 138.62,101.33 144.1,101.33 R4.1
  Bottom 0.61: MAPLE.X12 121.29,113.46 v121.35,113.52
IR_RECEIVE  (via drill 0.6)  (1 unrouted)
  Top 0.61: RECEIVE.P$1 16.54,111.15 16.96,110.73 16.96,109.02 R6.2 | v21.02,108.95 16.96,108.95
  Route15 0.61: v106.62,105.9 106.62,127.49 104.59,128.76 70.3,128.76 50.99,110.73 22.8,110.73 v21.02,108.95
  Bottom 0.61: MAPLE.X10 106.56,105.84 v106.62,105.9
IRQ1  (1 unrouted)
IRQ2  (1 unrouted)
IRQ3  (1 unrouted)
  Bottom 0.61: MAPLE.X0 104.14,80.44 105.86,78.72
KICK1
  Top 0.61: X2.5 97.85,48.88 95.19,51.55 95.19,62.98 82.74,75.42 82.74,91.17 85.03,93.46 87.07,93.46 MAPLE.X25
KICK2  (via drill 0.6)  (1 unrouted)
  Top 0.61: X2.6 97.85,46.34 93.92,50.28 93.92,61.45 v90.11,65.26
  Bottom 0.61: v90.11,65.26 90.11,89.65 89.09,90.66 87.31,90.66 87.06,90.92
MISO  (via drill 0.6)
  Route15 0.61: v18.48,64.25 18.99,64.75 75.12,64.75 78.42,68.06 78.42,81.01 80.4,82.98 MAPLE.X29 87.83,82.53 92.9,82.53 95.19,80.25 95.19,76.44 99,72.63 104.84,72.63 108.4,76.18 132.27,76.18 138.62,82.53 COM2.MISO | COM3.MISO 82.87,22.72 78.42,27.16 74.61,27.16 62.68,39.1 31.94,39.1 24.07,46.97 v24.07,60.44
  Bottom 0.61: COM1.MISO 18.48,74.66 v18.48,64.25 18.48,62.47 20.51,60.44 v24.07,60.44
MOSI
  Route15 0.61: MAPLE.X28 86.81,85.52 | 86.81,85.52 80.14,85.52 76.9,82.28 76.9,70.6 72.84,66.53 15.94,66.53 | 15.94,66.53 15.69,66.53 11.11,71.1 11.11,76.44 11.37,76.69 11.37,76.95 12.13,77.71 15.94,77.71 COM1.MOSI | 86.81,85.52 87,85.33 92.9,85.33 96.97,81.26 96.97,76.95 99.76,74.15 104.08,74.15 107.63,77.71 131.51,77.71 139.64,85.84 144.21,85.84 145.23,84.82 145.23,80.25 144.97,79.99 COM2.MOSI | COM3.MOSI 80.33,13.32 79.44,12.43 70.3,12.43 66.74,15.99 66.74,26.4 59.63,33.51 30.42,33.51 14.16,49.77 14.16,64.75 15.94,66.53
MUX  (1 unrouted)
N$1
  Top 1.27: XT60.V+ 53.77,130.93 58.36,126.35 58.36,120.89 58.49,120.76
  pour Top (no thermals): 37.15,134.73 60.64,134.73 60.64,116.06 54.55,116.06 54.55,125.21 52.77,126.98 37.15,126.98
N$2  (1 unrouted)
N$3
  Top 0.61: U$12.1 57.61,28.12 R8.1
N$4  (1 unrouted)
  Top 0.61: X2.2 105.73,56.5 106.87,57.64 106.87,59.42 | 106.87,59.42 106.87,60.18 107.89,60.18 108.14,59.93 | SENSE.1 106.94,59.49 106.87,59.42
N$5
  Top 0.61: U$13.P$1 50.06,17.85 51.25,19.03 55.31,19.03 56.58,20.3 56.58,22.66 U$12.3
N$6
  Top 0.61: R5.2 141.86,112.59 EMIT.P$1
N$7
  Top 0.61: EMIT.P$2 145.16,112.82 146.75,111.24 146.75,109.62 T2.3
N$8  (1 unrouted)
N$9  (1 unrouted)
N$10  (1 unrouted)
N$11
  Top 0.61: T2.1 145.67,106.34 144.21,104.89 144.21,103.44 R4.2
N$12
  Top 0.61: DRIVER3.VDRIVER 36.47,29.63 D2.1
N$13  (1 unrouted)
  Top 0.61: DRIVER2.VDRIVER 122,25.24 122.37,24.88 122.37,34.78 122.62,34.78
N$24  (1 unrouted)
SCK  (via drill 0.6)
  Route15 0.61: COM3.SCK 80.33,21.19 75.88,25.64 72.84,25.64 61.15,37.32 31.18,37.32 30.67,37.83 30.42,37.83 21.78,46.47 21.78,61.96 v21.27,62.47 22.54,63.74 77.66,63.74 80.96,67.04 80.96,78.22 83.19,80.44 MAPLE.X30 91.44,80.44 92.65,79.23 92.65,76.44 98.24,70.85 105.09,70.85 108.9,74.66 133.03,74.66 138.62,80.25 139.77,80.25 COM2.SCK
  Bottom 0.61: v21.27,62.47 21.27,76.44 20.51,77.2 18.99,77.2 COM1.SCK
V+  (1 unrouted)
  Top 0.61: REG3.3V.P$1 61.87,57.52 | 61.87,57.52 61.87,61 DRIVER5.V+3 | REG3.3V1.P$1 76.09,55.66 74.61,57.13 73.85,58.15 | 73.85,58.15 62.12,58.15 61.87,57.52 | REG5V.P$1 89.95,55.38 87.06,58.28 75.12,58.28 73.85,58.15 | R5.1 137.44,107.08 128.46,116.06 114.24,116.06 113.98,115.81 112.95,115.81 | R10.2 51.13,98.15 50.48,98.79 | 47.18,98.75 50.78,98.75 51.25,98.28 52.52,98.28 | SENSE.3 124.39,59.92 129.48,65.01 129.48,72.02 DRIVER2.V+3
  Top 1.27: DRIVER1.V+2 112.95,115.81 112.95,124.97 105.73,132.19 66.36,132.19 65.98,132.57 65.98,121.52 64.84,120.38 64.84,112.25 64.45,111.87 50.36,111.87 47.06,108.57
  Top 1.422: 47.06,108.82 47.06,108.57 47.18,98.75 47.31,88.12 | 47.31,88.12 44.01,84.82 32.2,84.82 27.62,80.25 27.62,78.21 DRIVER4.V+2 | DRIVER5.V+3 DRIVER5.V+2 | DRIVER5.V+2 49.79,65.71 46.29,69.2 46.29,72.13 DRIVER3.V+2 | DRIVER5.V+2 58.43,80.18 | 58.43,80.18 47.18,84.69 47.31,88.12 | DRIVER2.V+2 131.25,77.08 128.34,79.99 118.94,79.99 DRIVER1.V+2 | 59.37,79.87 58.87,80.38 58.63,80.38 58.43,80.18 | DRIVER2.V+2 DRIVER2.V+3 | DRIVER2.V+1 DRIVER2.V+2
  pour Top (no thermals): 62.3,125.46 68.39,125.46 68.39,111.62 66.36,109.59 59.76,109.59 56.96,106.79 56.96,85.46 63.69,78.72 63.69,60.06 62.93,59.29 52.26,59.29 41.09,70.47 41.09,74.15 51.63,74.28 51.63,81.01 32.58,81.01 32.58,75.68 22.42,75.68 22.67,85.46 28.13,90.92 41.47,91.17 45.15,94.85 45.15,110.35 49.34,114.54 61.53,114.54 62.3,115.3
  pour Top (no thermals): 62.3,116.7 62.3,134.73 108.02,134.73 117.16,125.59 117.16,87.23 122.75,81.65 130.75,81.65 136.34,76.06 136.34,70.22 127.19,70.22 127.19,74.03 126.43,74.79 114.37,74.79 107.89,81.26 107.89,124.7 103.82,128.76 71.57,128.76 68.39,125.59 68.39,116.82
VCC  (6 unrouted)
  Top 0.61: U$4.+ 84.43,51.11 REG5V.P$3 84.87,54.64 C1.2
  Bottom 0.61: DRIVER4.VCC 31.77,116.87 34.99,113.65 35.12,113.65 36.64,112.13 36.64,112 39.18,109.46 62.04,109.46 63.57,107.93 63.57,106.05 DRIVER5.VCC

### Text on the board
tPlace: MAIN | SWITCH | SHORT | LONG | LONG | SHORT | IR EMIT | IR RCV | KICKER | COM1 | COM3 | RHOBAN SSL rev1 | COM2
tSilk: 1 | 4 | 5 | 3 | 2
_tsilk: DRIVER | DRIVER | DRIVER | DRIVER | DRIVER | 3.3V | 5V | 12V
_bsilk: 4 | 3 | 2 | 1